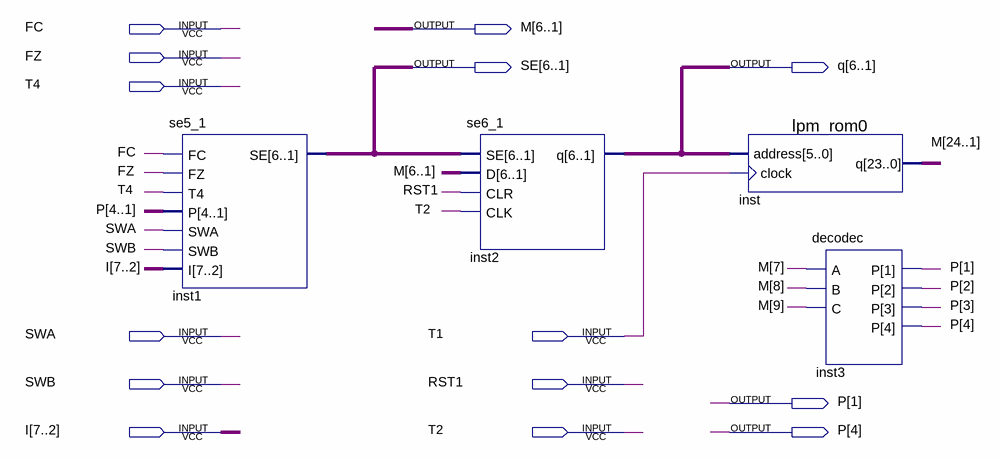
[diagram p0: schematic sheet]
// Quartus schematic uCONTROL.bdf as structural Verilog: 4 symbols, 14 pins
module uCONTROL (
  input  FC,
  input  FZ,
  input  T4,
  input  SWA,
  input  T1,
  input  SWB,
  input  RST1,
  input  [7:2] I,
  input  T2,
  output [24:1] M,
  output [6:1] SE,
  output [6:1] q,
  output [4:1] P
);

  se5_1 inst1 (.FC(FC), .FZ(FZ), .T4(T4), .P(P), .SWA(SWA), .SWB(SWB), .I(I), .SE(SE));
  se6_1 inst2 (.SE(SE), .D(M[6:1]), .CLR(RST1), .CLK(T2), .q(q));
  lpm_rom0 inst (.address(q), .clock(T1), .q(M));
  decodec inst3 (.A(M[7]), .B(M[8]), .C(M[9]), .P(P));
endmodule
